# Altium schematic sheet STM32_EVK (2).SchDoc
size A3
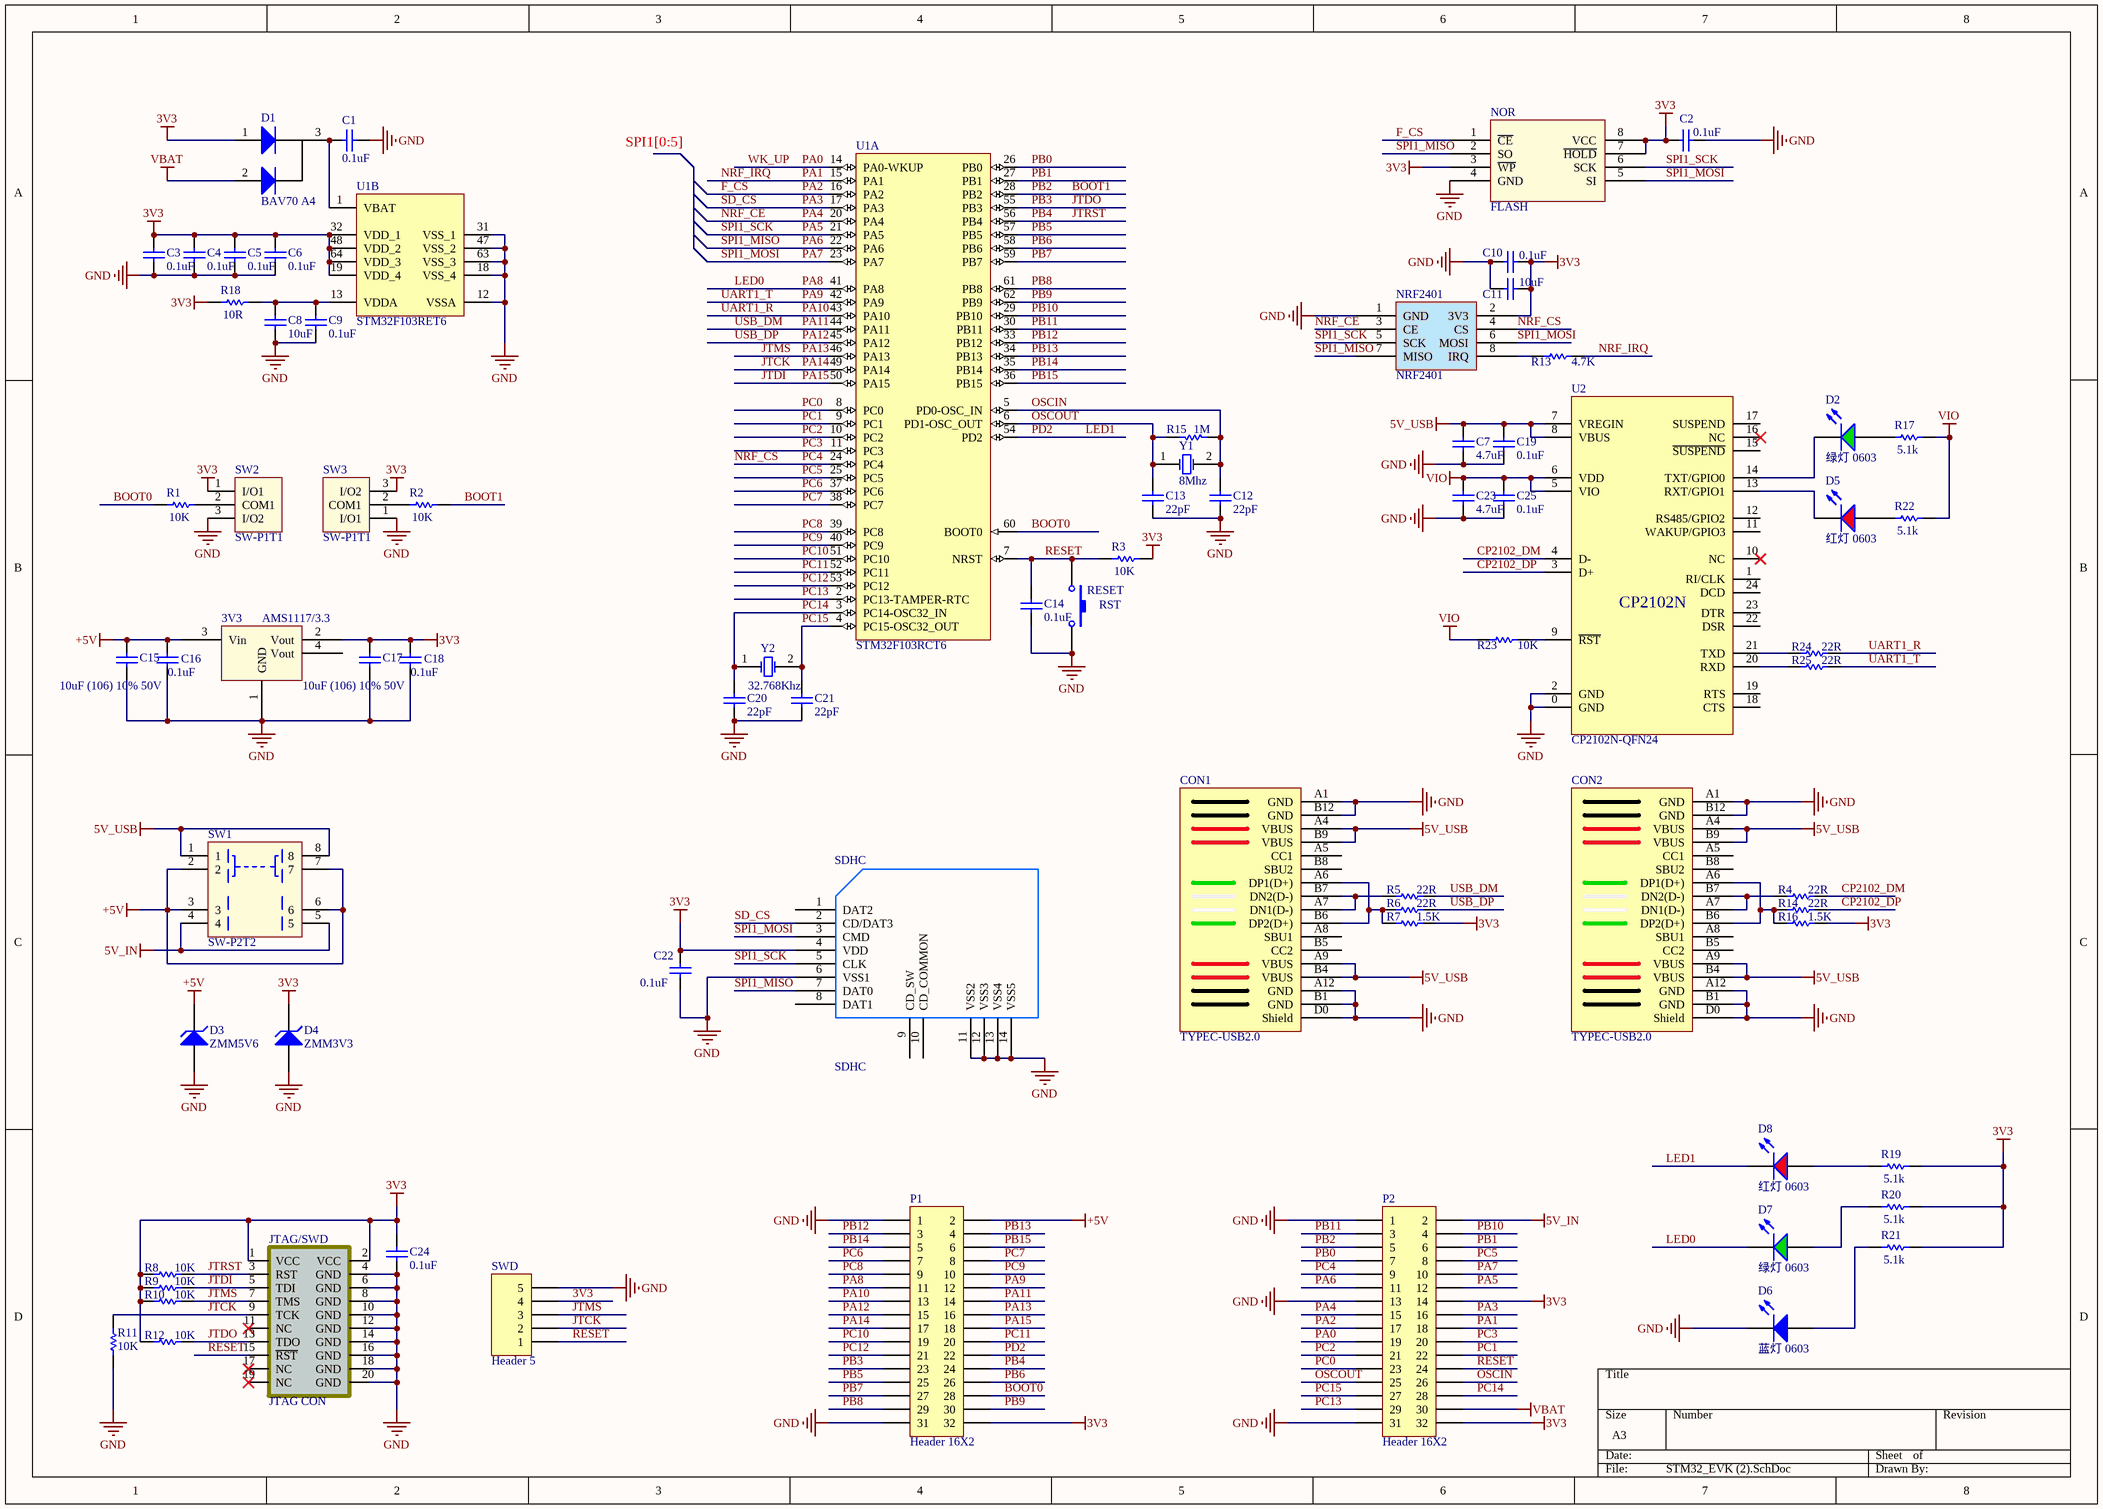
[diagram p0: STM32_EVK (2).SchDoc]

## Parts
3V3  AMS1117/3.3  [LC-SOT-223]
C1  value 0.1uF  [LC-0603_C]  (hidden comment: Cap)
C2  value 0.1uF  [LC-0603_C]  (hidden comment: Cap)
C3  value 0.1uF  [LC-0603_C]  (hidden comment: Cap)
C4  value 0.1uF  [LC-0603_C]  (hidden comment: Cap)
C5  value 0.1uF  [LC-0603_C]  (hidden comment: Cap)
C6  value 0.1uF  [LC-0603_C]  (hidden comment: Cap)
C7  value 4.7uF  [LC-0603_C]  (hidden comment: Cap)
C8  value 10uF  [LC-0603_C]  (hidden comment: Cap)
C9  value 0.1uF  [LC-0603_C]  (hidden comment: Cap)
C10  value 0.1uF  [LC-0603_C]  (hidden comment: Cap)
C11  value 10uF  [LC-0603_C]  (hidden comment: Cap)
C12  value 22pF  [LC-0603_C]  (hidden comment: Cap)
C13  value 22pF  [LC-0603_C]  (hidden comment: Cap)
C14  value 0.1uF  [LC-0603_C]  (hidden comment: Cap)
C15  10uF (106) 10% 50V  [LC-1206_C]
C16  value 0.1uF  [LC-0603_C]  (hidden comment: Cap Semi)
C17  10uF (106) 10% 50V  [LC-1206_C]
C18  value 0.1uF  [LC-0603_C]  (hidden comment: Cap Semi)
C19  value 0.1uF  [LC-0603_C]  (hidden comment: Cap)
C20  value 22pF  [LC-0603_C]  (hidden comment: Cap)
C21  value 22pF  [LC-0603_C]  (hidden comment: Cap)
C22  value 0.1uF  [LC-0603_C]  (hidden comment: Cap)
C23  value 4.7uF  [LC-0603_C]  (hidden comment: Cap)
C24  value 0.1uF  [LC-0603_C]  (hidden comment: Cap)
C25  value 0.1uF  [LC-0603_C]  (hidden comment: Cap)
CON1  TYPEC-USB2.0  [TYPEC-USB2.0]
CON2  TYPEC-USB2.0  [TYPEC-USB2.0]
D1  BAV70 A4  [LC-SOT-23(SOT-23-3)]
D2  绿灯 0603  [LC-0603_LED_S1]
D3  ZMM5V6  [LC-LL-34]
D4  ZMM3V3  [LC-LL-34]
D5  红灯 0603  [LC-0603_LED_S1]
D6  蓝灯 0603  [LC-0603_LED_S1]
D7  绿灯 0603  [LC-0603_LED_S1]
D8  红灯 0603  [LC-0603_LED_S1]
JTAG/SWD  JTAG CON  [20Pin简牛]
NOR  FLASH  [M25P32_SOP8W]
NRF2401  NRF2401  [HDR2X4]
P1  Header 16X2  [HDR2X16]
P2  Header 16X2  [HDR2X16]
R1  value 10K  [LC-0603_R]  (hidden comment: Res Semi)
R2  value 10K  [LC-0603_R]  (hidden comment: Res Semi)
R3  value 10K  [LC-0603_R]  (hidden comment: Res Semi)
R4  value 22R  [LC-0603_R]  (hidden comment: Res Semi)
R5  value 22R  [LC-0603_R]  (hidden comment: Res Semi)
R6  value 22R  [LC-0603_R]  (hidden comment: Res Semi)
R7  value 1.5K  [LC-0603_R]  (hidden comment: Res Semi)
R8  value 10K  [LC-0603_R]  (hidden comment: Res Semi)
R9  value 10K  [LC-0603_R]  (hidden comment: Res Semi)
R10  value 10K  [LC-0603_R]  (hidden comment: Res Semi)
R11  value 10K  [LC-0603_R]  (hidden comment: Res Semi)
R12  value 10K  [LC-0603_R]  (hidden comment: Res Semi)
R13  value 4.7K  [LC-0603_R]  (hidden comment: Res Semi)
R14  value 22R  [LC-0603_R]  (hidden comment: Res Semi)
R15  value 1M  [LC-0603_R]  (hidden comment: Res Semi)
R16  value 1.5K  [LC-0603_R]  (hidden comment: Res Semi)
R17  value 5.1k  [LC-0603_R]  (hidden comment: Res Semi)
R18  value 10R  [LC-0603_R]  (hidden comment: Res Semi)
R19  value 5.1k  [LC-0603_R]  (hidden comment: Res Semi)
R20  value 5.1k  [LC-0603_R]  (hidden comment: Res Semi)
R21  value 5.1k  [LC-0603_R]  (hidden comment: Res Semi)
R22  value 5.1k  [LC-0603_R]  (hidden comment: Res Semi)
R23  value 10K  [LC-0603_R]  (hidden comment: Res Semi)
R24  value 22R  [LC-0603_R]  (hidden comment: Res Semi)
R25  value 22R  [LC-0603_R]  (hidden comment: Res Semi)
RESET  RST  [ALPS_SKPMA_KEY]
SDHC  SDHC  [microSD]
SW1  SW-P2T2  [SW-P2T2]
SW2  SW-P1T1  [SW-P1T1]
SW3  SW-P1T1  [SW-P1T1-JUMP]
SWD  Header 5  [HDR1X5]
U1  STM32F103RCT6  [LC-LQFP-64_10x10x05P]  (parts A,B of 2)
U2  CP2102N-QFN24  [LC-QFN-24_4x4x05P]
Y1  8Mhz  [XTAL-RAD-0.2]
Y2  32.768Khz  [32768_3*8_圆筒晶振]

## Nets
3V3: 3V3.2(Vout) C2.2 C3.2 C4.2 C5.2 C6.2 C10.1 C11.1 C17.2 C18.2 C22.2 C24.2 D1.1(A) D4.2(K) JTAG/SWD.1(VCC) JTAG/SWD.2(VCC) NOR.3(~{WP}) NOR.7(~{HOLD}) NOR.8(VCC) NRF2401.2(3V3) P1.32 P2.14 P2.32 R3.2 R7.2 R8.1 R9.1 R10.1 R12.1 R16.2 R18.1 R19.2 R20.2 R21.2 SDHC.4(VDD) SW2.1(I/O1) SW3.3(I/O2) SWD.4 U1.19(VDD_4) U1.32(VDD_1) U1.48(VDD_2) U1.64(VDD_3)
5V_IN: P2.2 SW1.4 SW1.5
5V_USB: C7.2 C19.2 CON1.A4(VBUS) CON1.A9(VBUS) CON1.B4(VBUS) CON1.B9(VBUS) CON2.A4(VBUS) CON2.A9(VBUS) CON2.B4(VBUS) CON2.B9(VBUS) SW1.1 SW1.8 U2.7(VREGIN) U2.8(VBUS)
+5V: 3V3.3(Vin) C15.2 C16.2 D3.2(K) P1.2 SW1.2 SW1.3 SW1.6 SW1.7
GND: 3V3.1(GND) C1.1 C2.1 C3.1 C4.1 C5.1 C6.1 C7.1 C8.1 C9.1 C10.2 C11.2 C12.1 C13.1 C14.1 C15.1 C16.1 C17.1 C18.1 C19.1 C20.1 C21.1 C22.1 C23.1 C24.1 C25.1 CON1.A1(GND) CON1.A12(GND) CON1.B1(GND) CON1.B12(GND) CON1.D0(Shield) CON2.A1(GND) CON2.A12(GND) CON2.B1(GND) CON2.B12(GND) CON2.D0(Shield) D3.1(A) D4.1(A) D6.K JTAG/SWD.4(GND) JTAG/SWD.6(GND) JTAG/SWD.8(GND) JTAG/SWD.10(GND) JTAG/SWD.12(GND) JTAG/SWD.14(GND) JTAG/SWD.16(GND) JTAG/SWD.18(GND) JTAG/SWD.20(GND) NOR.4(GND) NRF2401.1(GND) P1.1 P1.31 P2.1 P2.13 P2.31 R11.1 RESET.2 SDHC.6(VSS1) SDHC.11(VSS2) SDHC.12(VSS3) SDHC.13(VSS4) SDHC.14(VSS5) SW2.3(I/O2) SW3.1(I/O1) SWD.5 U1.12(VSSA) U1.18(VSS_4) U1.31(VSS_1) U1.47(VSS_2) U1.63(VSS_3) U2.0(GND) U2.2(GND)
VBAT: D1.2(A) P2.30
VIO: C23.2 C25.2 R17.2 R22.2 R23.1 U2.5(VIO) U2.6(VDD)
BOOT0: P1.28 R1.1 U1.60(BOOT0)
BOOT1: P2.5 R2.2 U1.28(PB2)  [also labelled PB2]
CP2102_DM: R4.2 U2.4(D-)
CP2102_DP: R14.2 U2.3(D+)
F_CS: NOR.1(~{CE}) P2.17 U1.16(PA2)  [also labelled PA2]
JTCK: JTAG/SWD.9(TCK) P1.17 R11.2 SWD.2 U1.49(PA14)  [also labelled PA14]
JTDI: JTAG/SWD.5(TDI) P1.18 R9.2 U1.50(PA15)  [also labelled PA15]
JTDO: JTAG/SWD.13(TDO) P1.23 R12.2 U1.55(PB3)  [also labelled PB3]
JTMS: JTAG/SWD.7(TMS) P1.16 R10.2 SWD.3 U1.46(PA13)  [also labelled PA13]
JTRST: JTAG/SWD.3(RST) P1.24 R8.2 U1.56(PB4)  [also labelled PB4]
LED0: D7.K P1.11 U1.41(PA8)  [also labelled PA8]
LED1: D8.K P1.22 U1.54(PD2)  [also labelled PD2]
NRF_CE: NRF2401.3(CE) P2.15 U1.20(PA4)  [also labelled PA4]
NRF_CS: NRF2401.4(CS) P2.9 U1.24(PC4)  [also labelled PC4]
NRF_IRQ: P2.18 R13.2 U1.15(PA1)  [also labelled PA1]
OSCIN: C12.2 P2.26 R15.1 U1.5(PD0-OSC_IN) Y1.2(OSC2)
OSCOUT: C13.2 P2.25 R15.2 U1.6(PD1-OSC_OUT) Y1.1(OSC1)
PA0: P2.19 U1.14(PA0-WKUP)  [also labelled WK_UP]
PA3: P2.16 SDHC.2(CD/DAT3) U1.17(PA3)  [also labelled SD_CS]
PA5: NOR.6(SCK) NRF2401.5(SCK) P2.12 SDHC.5(CLK) U1.21(PA5)  [also labelled SPI1_SCK]
PA6: NOR.2(SO) NRF2401.7(MISO) P2.11 SDHC.7(DAT0) U1.22(PA6)  [also labelled SPI1_MISO]
PA7: NOR.5(SI) NRF2401.6(MOSI) P2.10 SDHC.3(CMD) U1.23(PA7)  [also labelled SPI1_MOSI]
PA9: P1.12 R25.2 U1.42(PA9)  [also labelled UART1_T]
PA10: P1.13 R24.2 U1.43(PA10)  [also labelled UART1_R]
PA11: P1.14 R5.2 U1.44(PA11)  [also labelled USB_DM]
PA12: P1.15 R6.2 U1.45(PA12)  [also labelled USB_DP]
PB0: P2.7 U1.26(PB0)
PB1: P2.6 U1.27(PB1)
PB5: P1.25 U1.57(PB5)
PB6: P1.26 U1.58(PB6)
PB7: P1.27 U1.59(PB7)
PB8: P1.29 U1.61(PB8)
PB9: P1.30 U1.62(PB9)
PB10: P2.4 U1.29(PB10)
PB11: P2.3 U1.30(PB11)
PB12: P1.3 U1.33(PB12)
PB13: P1.4 U1.34(PB13)
PB14: P1.5 U1.35(PB14)
PB15: P1.6 U1.36(PB15)
PC0: P2.23 U1.8(PC0)
PC1: P2.22 U1.9(PC1)
PC2: P2.21 U1.10(PC2)
PC3: P2.20 U1.11(PC3)
PC5: P2.8 U1.25(PC5)
PC6: P1.7 U1.37(PC6)
PC7: P1.8 U1.38(PC7)
PC8: P1.9 U1.39(PC8)
PC9: P1.10 U1.40(PC9)
PC10: P1.19 U1.51(PC10)
PC11: P1.20 U1.52(PC11)
PC12: P1.21 U1.53(PC12)
PC13: P2.29 U1.2(PC13-TAMPER-RTC)
PC14: C20.2 P2.28 U1.3(PC14-OSC32_IN) Y2.1(OSC1)
PC15: C21.2 P2.27 U1.4(PC15-OSC32_OUT) Y2.2(OSC2)
RESET: C14.2 JTAG/SWD.15(~{RST}) P2.24 R3.1 RESET.1 SWD.1 U1.7(NRST)
NetC1_2: C1.2 D1.3(K) U1.1(VBAT)
NetC8_2: C8.2 C9.2 R18.2 U1.13(VDDA)
NetCON1_A6: CON1.A6(DP1(D+)) CON1.B6(DP2(D+)) R6.1 R7.1
NetCON1_A7: CON1.A7(DN1(D-)) CON1.B7(DN2(D-)) R5.1
NetCON2_A6: CON2.A6(DP1(D+)) CON2.B6(DP2(D+)) R14.1 R16.1
NetCON2_A7: CON2.A7(DN1(D-)) CON2.B7(DN2(D-)) R4.1
NetD2_A: D2.A R17.1
NetD2_K: D2.K U2.14(TXT/GPIO0)
NetD5_A: D5.A R22.1
NetD5_K: D5.K U2.13(RXT/GPIO1)
NetD6_A: D6.A R21.1
NetD7_A: D7.A R20.1
NetD8_A: D8.A R19.1
NetNRF2401_8: NRF2401.8(IRQ) R13.1
NetR1_2: R1.2 SW2.2(COM1)
NetR2_1: R2.1 SW3.2(COM1)
NetR23_2: R23.2 U2.9(~{RST})
NetR24_1: R24.1 U2.21(TXD)
NetR25_1: R25.1 U2.20(RXD)

Not connected (* = marked no-connect by the designer): 3V3 4(Vout); CON1 A5(CC1) A8(SBU1) B5(CC2) B8(SBU2); CON2 A5(CC1) A8(SBU1) B5(CC2) B8(SBU2); JTAG/SWD 11(NC)* 17(NC)* 19(NC)*; SDHC 1(DAT2) 8(DAT1) 9(CD_SW) 10(CD_COMMON); U2 1(RI/CLK) 10(NC)* 11(WAKUP/GPIO3) 12(RS485/GPIO2) 15(~{SUSPEND}) 16(NC)* 17(SUSPEND) 18(CTS) 19(RTS) 22(DSR) 23(DTR) 24(DCD)

## Notes on the sheet
- SPI1[0:5]
- (in symbol CP2102N-QFN24) CP2102N

## Library data of the parts
3V3 = AMS1117
C1-C14 C19-C25 = Cap: Capacitor; Published: 8-Jun-2000; LatestRevisionDate: 17-Jul-2002; LatestRevisionNote: Re-released for DXP Platform.; PackageReference: RAD-0.3; Publisher: Altium Limited; PackageDescription: Radial Cap, Thru-Hole; 2 Leads; 0.3 in Pin Spacing
C15 C17 = 1206 10uF (106) 10% 50V: 贴片电容; ComponentLink1Description: 供应商链接; ComponentLink1URL: http://www.szlcsc.com/product/details_14236.html; Package: 1206; Supplier: LC; SuppliersPartNumber: C13585
C16 C18 = Cap Semi: Capacitor (Semiconductor SIM Model); Published: 8-Jun-2000; LatestRevisionDate: 29-May-2009; LatestRevisionNote: IPC-7351 Footprint Added.; PackageReference: C1206; Publisher: Altium Limited; PackageDescription: Chip Capacitor
D1 = SOT-23 BAV70 A4: 开关二极管; ComponentLink1Description: 供应商链接; ComponentLink1URL: http://www.szlcsc.com/product/details_70091.html; Package: SOT-23; Supplier: LC; SuppliersPartNumber: C68978
D2 D7 = 0603 绿灯: 发光二极管; ComponentLink1Description: 供应商链接; ComponentLink1URL: http://www.szlcsc.com/product/details_73152.html; Package: 0603; Supplier: LC; SuppliersPartNumber: C72043
D3 = LL-34 ZMM5V6: 稳压二极管; ComponentLink1Description: 供应商链接; ComponentLink1URL: http://www.szlcsc.com/product/details_8541.html; Package: LL-34; Supplier: LC; SuppliersPartNumber: C8062
D4 = LL-34 ZMM3V3: 稳压二极管; ComponentLink1Description: 供应商链接; ComponentLink1URL: http://www.szlcsc.com/product/details_8535.html; Package: LL-34; Supplier: LC; SuppliersPartNumber: C8056
D5 D8 = 0603 红灯: 发光二极管; ComponentLink1Description: 供应商链接; ComponentLink1URL: http://www.szlcsc.com/product/details_2659.html; Package: 0603; Supplier: LC; SuppliersPartNumber: C2286
D6 = 0603 蓝灯: 发光二极管; ComponentLink1Description: 供应商链接; ComponentLink1URL: http://www.szlcsc.com/product/details_73150.html; Package: 0603; Supplier: LC; SuppliersPartNumber: C72041
JTAG/SWD = JTAG
P1 P2 = Header 16X2: Header, 16-Pin, Dual row; LatestRevisionDate: 17-Jul-2002; LatestRevisionNote: Re-released for DXP Platform.; Publisher: Altium Limited
R1-R25 = Res Semi: Semiconductor Resistor; Published: 8-Jun-2000; LatestRevisionDate: 17-Jul-2002; LatestRevisionNote: Re-released for DXP Platform.; PackageReference: AXIAL-0.5; Publisher: Altium Limited; PackageDescription: Axial Device, Thru-Hole; 2 Leads; 0.5 in Pin Spacing
RESET = SW-PB: Switch; Published: 24-Mar-1999; LatestRevisionDate: 17-Jul-2002; LatestRevisionNote: Re-released for DXP Platform.; PackageReference: SPST-2; Publisher: Altium Limited; PackageDescription: Switch; 2 Leads
SDHC = SDHC: pin to pad: 11>G1 12>G2 13>G3 14>G4
SWD = Header 5: Header, 5-Pin; LatestRevisionDate: 17-Jul-2002; LatestRevisionNote: Re-released for DXP Platform.; Publisher: Altium Limited
U1 = STM32F103RET6: ARM Cortex-M3 32-bit MCU, 512 KB Flash, 64 KB Internal RAM, 51 I/Os, 64-pin LQFP, -40 to 85 degC, Tray; A/D Converter: 3x12-bit (16 Channel); D/A Converter: 2x12-bit (2 Channel); FLASH Size (Prog) (kB): 512; I/Os (High Current): 51; Internal RAM Size (kB): 64; Operating Frequency(F) (Processor speed) (MHz): 72; Supply Voltage(Vcc) min (V): 2; DatasheetVersion: Rev. 8; PackageVersion: Rev. 4, 06/2013; PackageReference: LQFP64; PackageDescription: 64-Pin Low Profile Quad Flat Package, 10 x 10 mm Body, 0.5 mm Pitch; Supplier 1: Digi-Key; Supplier Part Number 1: 497-6444-ND; Supplier 2: Farnell; Supplier Part Number 2: 1624138; Supplier 3: Newark; Supplier Part Number 3: 01P4101; Supplier 4: Newark; Supplier Part Number 4: 57P1231; Supplier 5: Mouser; Supplier Part Number 5: 511-STM32F103RET6; Core: ARM Cortex-M3; Packing: Tray; Mounting Technology: Surface Mount; PartNumber: STM32F103RET6; ComponentLink1Description: Manufacturer URL; ComponentLink1URL: http://www.st.com/web/en/home.html; ComponentLink2Description: Datasheet; ComponentLink2URL: http://www.st.com/st-web-ui/static/active/en/resource/technical/document/datasheet/CD00191185.pdf; ComponentLink3Description: Package Specification; ComponentLink3URL: http://www.st.com/st-web-ui/static/active/en/resource/technical/document/datasheet/DM00037051.pdf
Y1 Y2 = XTAL: Crystal Oscillator; Published: 8-Jun-2000; LatestRevisionDate: 17-Jul-2002; LatestRevisionNote: Re-released for DXP Platform.; PackageReference: R38; Publisher: Altium Limited; PackageDescription: Crystal, Thru-Hole; 2 Leads; Body 3.1 x 8.2 mm (Dia.xH)